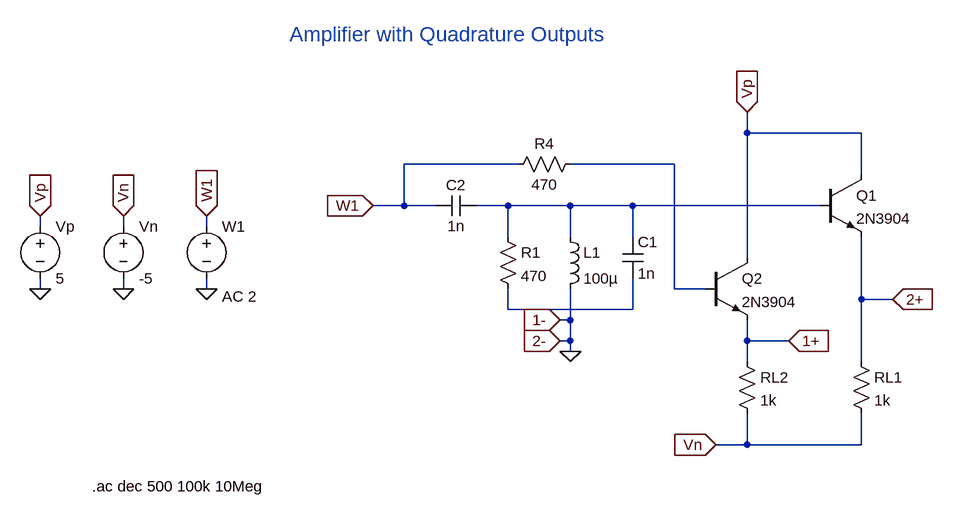
[diagram p0: schematic quad_amplifier.asc]
quad_amplifier.asc, the LTspice schematic file:
Version 4
SHEET 1 1096 680
WIRE 560 -64 560 -96
WIRE 736 -64 560 -64
WIRE 208 -16 32 -16
WIRE 448 -16 288 -16
WIRE 736 0 736 -64
WIRE 32 48 32 -16
WIRE 32 48 -16 48
WIRE 80 48 32 48
WIRE 192 48 144 48
WIRE 288 48 192 48
WIRE 384 48 288 48
WIRE 672 48 384 48
WIRE -528 80 -528 64
WIRE -400 80 -400 64
WIRE -272 80 -272 64
WIRE 192 96 192 48
WIRE 288 96 288 48
WIRE 384 96 384 48
WIRE 560 128 560 -64
WIRE -528 176 -528 160
WIRE -400 176 -400 160
WIRE -272 176 -272 160
WIRE 448 176 448 -16
WIRE 496 176 448 176
WIRE 736 192 736 96
WIRE 784 192 736 192
WIRE 192 208 192 176
WIRE 384 208 384 160
WIRE 384 208 192 208
WIRE 288 224 288 176
WIRE 288 224 272 224
WIRE 288 256 288 224
WIRE 288 256 272 256
WIRE 560 256 560 224
WIRE 624 256 560 256
WIRE 288 272 288 256
WIRE 560 288 560 256
WIRE 736 288 736 192
WIRE 560 416 560 368
WIRE 560 416 512 416
WIRE 736 416 736 368
WIRE 736 416 560 416
FLAG 288 272 0
FLAG 560 -96 Vp
IOPIN 560 -96 In
FLAG 512 416 Vn
IOPIN 512 416 In
FLAG -16 48 W1
IOPIN -16 48 In
FLAG 272 224 1-
IOPIN 272 224 In
FLAG 272 256 2-
IOPIN 272 256 In
FLAG 624 256 1+
IOPIN 624 256 In
FLAG 784 192 2+
IOPIN 784 192 In
FLAG -528 176 0
FLAG -400 176 0
FLAG -272 176 0
FLAG -528 64 Vp
IOPIN -528 64 In
FLAG -400 64 Vn
IOPIN -400 64 In
FLAG -272 64 W1
IOPIN -272 64 In
SYMBOL res 176 80 R0
SYMATTR InstName R1
SYMATTR Value 470
SYMBOL res 544 272 R0
SYMATTR InstName RL2
SYMATTR Value 1k
SYMBOL res 720 272 R0
SYMATTR InstName RL1
SYMATTR Value 1k
SYMBOL res 304 -32 R90
WINDOW 0 0 56 VBottom 2
WINDOW 3 32 56 VTop 2
SYMATTR InstName R4
SYMATTR Value 470
SYMBOL ind 272 80 R0
SYMATTR InstName L1
SYMATTR Value 100µ
SYMBOL cap 368 96 R0
SYMATTR InstName C1
SYMATTR Value 1n
SYMBOL cap 144 32 R90
WINDOW 0 0 32 VBottom 2
WINDOW 3 32 32 VTop 2
SYMATTR InstName C2
SYMATTR Value 1n
SYMBOL npn 496 128 R0
SYMATTR InstName Q2
SYMATTR Value 2N3904
SYMBOL npn 672 0 R0
SYMATTR InstName Q1
SYMATTR Value 2N3904
SYMBOL voltage -528 64 R0
WINDOW 123 0 0 Left 0
WINDOW 39 0 0 Left 0
SYMATTR InstName Vp
SYMATTR Value 5
SYMBOL voltage -400 64 R0
SYMATTR InstName Vn
SYMATTR Value -5
SYMBOL voltage -272 64 R0
WINDOW 123 24 124 Left 2
WINDOW 39 0 0 Left 0
SYMATTR Value2 AC 2
SYMATTR InstName W1
SYMATTR Value ""
TEXT -144 -216 Left 3 ;Amplifier with Quadrature Outputs
TEXT -448 480 Left 2 !.ac dec 500 100k 10Meg

The netlist it stands for:
* quad_amplifier.asc
R1 N002 N003 470
RL2 1+ Vn 1k
RL1 2+ Vn 1k
R4 N001 W1 470
L1 N002 0 100µ
C1 N002 N003 1n
C2 N002 W1 1n
Q2 Vp N001 1+ 0 2N3904
Q1 Vp N002 2+ 0 2N3904
Vp Vp 0 5
Vn Vn 0 -5
V§W1 W1 0 AC 2
.model NPN NPN
.model PNP PNP
.lib standard.bjt
* Amplifier with Quadrature Outputs
.ac dec 500 100k 10Meg
.backanno
.end